# EAGLE schematic test-aetzen (EAGLE 7.1.0)
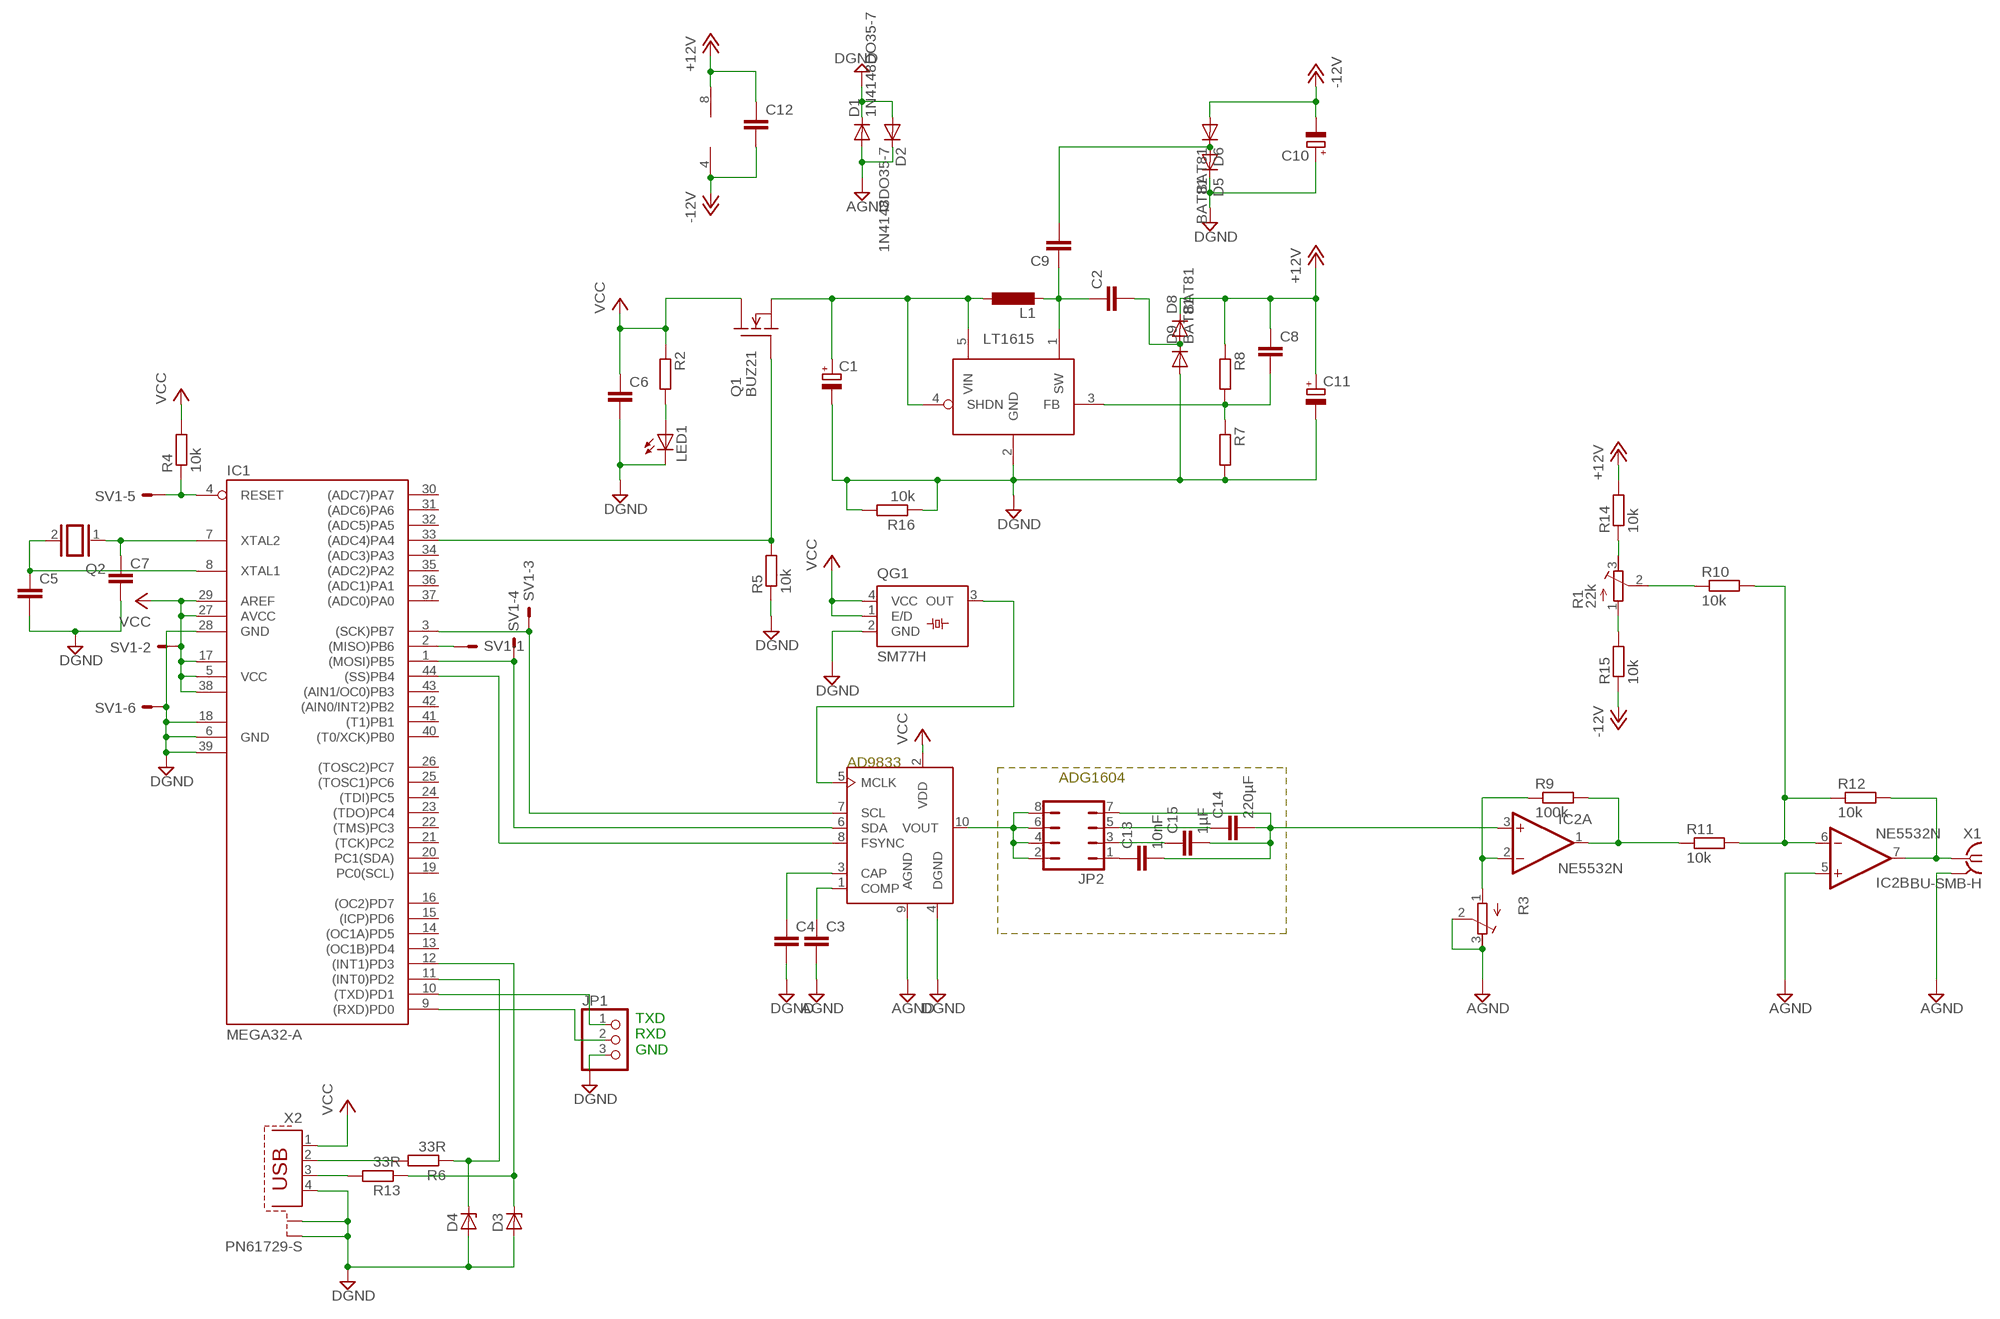
[diagram p0: schematic, sheet 1]

## Parts
C1  CPOL-EUE3.5-8  [E3,5-8]
C2  C-EU025-024X044  [C025-024X044]
C3  C-EU025-024X044  [C025-024X044]
C4  C-EU025-024X044  [C025-024X044]
C5  C-EU025-024X044  [C025-024X044]
C6  C-EU025-024X044  [C025-024X044]
C7  C-EU025-024X044  [C025-024X044]
C8  C-EU025-024X044  [C025-024X044]
C9  C-EU025-024X044  [C025-024X044]
C10  CPOL-EUE3.5-8  [E3,5-8]
C11  CPOL-EUE3.5-8  [E3,5-8]
C12  C-EU025-024X044  [C025-024X044]
C13  10nF  C-EU025-024X044  [C025-024X044]
C14  220µF  C-EU025-024X044  [C025-024X044]
C15  1µF  C-EU025-024X044  [C025-024X044]
D1  1N4148DO35-7  [DO35-7]
D2  1N4148DO35-7  [DO35-7]
D3  ZENER-DIODEDO35Z10  [DO35Z10]
D4  ZENER-DIODEDO35Z10  [DO35Z10]
D5  BAT81  [DO34-7]
D6  BAT81  [DO34-7]
D8  BAT81  [DO34-7]
D9  BAT81  [DO34-7]
IC1  MEGA32-A  [TQFP44]
IC2  NE5532N  [DIL08]
JP1  PINHD-1X3  [1X03]
JP2  JP4Q  [JP4Q]
L1  L-EU0207/10  [0207/10]
LED1  LED5MM  [LED5MM]
Q1  BUZ21  [TO220V]
Q2  XTAL/S  [QS]
QG1  SM77H  [SM77H]
R1  22k  R-TRIMM64Y  [RTRIM64Y]
R2  R-EU_0207/10  [0207/10]
R3  R-TRIMM64Y  [RTRIM64Y]
R4  10k  R-EU_M1206  [M1206]
R5  10k  R-EU_M1206  [M1206]
R6  33R  R-EU_0207/10  [0207/10]
R7  R-EU_0207/10  [0207/10]
R8  R-EU_0207/10  [0207/10]
R9  100k  R-EU_0207/10  [0207/10]
R10  10k  R-EU_M1206  [M1206]
R11  10k  R-EU_M1206  [M1206]
R12  10k  R-EU_M1206  [M1206]
R13  33R  R-EU_0207/10  [0207/10]
R14  10k  R-EU_M1206  [M1206]
R15  10k  R-EU_M1206  [M1206]
R16  10k  R-EU_M1206  [M1206]
SV1  ML6E  [ML6]
U$1  AD9833-P  [DIL10]
U$2  LT1615  [SOT23-5]
X1  BU-SMB-H  [BU-SMB-H]
X2  PN61729-S  [PN61729-S]

## Nets
+12V: C8.1 C11.+ C12.1 D8.C IC2.8(P:V+) R8.1 R14.2
-12V: C10.- C12.2 D6.A IC2.4(P:V-) R15.1
AGND: C3.2 D1.A D2.C IC2.5(B:+IN) R3.2(S) R3.3(E) U$1.9(AGND) X1.2 X1.3 X1.4 X1.5
DGND: C1.- C4.2 C5.2 C6.2 C7.2 C10.+ C11.- D1.C D2.A D3.A D4.A D5.C D9.A IC1.6(GND) IC1.18(GND1) IC1.28(GND) IC1.39(GND2) JP1.3 LED1.K(C) QG1.2(GND) R5.1 R7.2 R16.1 R16.2 SV1.6 U$1.4(DGND) U$2.2(GND) X2.4 X2.S1 X2.S2
N$1: IC1.3((SCK)PB7) SV1.3 U$1.7(SCL)
N$2: D4.C IC1.11((INT0)PD2) R6.1
N$3: C3.1 U$1.1(COMP)
N$4: IC1.1((MOSI)PB5) SV1.4 U$1.6(SDA)
N$5: D3.C IC1.12((INT1)PD3) R13.1
N$6: IC1.44((SS)PB4) U$1.8(FSYNC)
N$7: C1.+ L1.1 Q1.3(S) U$2.4(SHDN) U$2.5(VIN)
N$8: IC1.2((MISO)PB6) SV1.1
N$9: C4.1 U$1.3(CAP)
N$10: IC1.4(RESET) R4.1 SV1.5
N$11: QG1.3(OUT) U$1.5(MCLK)
N$12: IC1.33((ADC4)PA4) Q1.1(G) R5.2
N$13: R6.2 X2.2
N$14: R13.2 X2.3
N$15: R1.3(E) R14.1
N$16: IC1.9((RXD)PD0) JP1.2
N$17: LED1.A R2.2
N$18: R1.1(A) R15.2
N$19: C7.1 IC1.7(XTAL2) Q2.1
N$20: C8.2 R7.1 R8.2 U$2.3(FB)
N$21: JP2.2 JP2.4 JP2.6 JP2.8 U$1.10(VOUT)
N$22: C9.2 D5.A D6.C
N$23: C2.1 C9.1 L1.2 U$2.1(SW)
N$24: C14.1 JP2.5
N$25: C2.2 D8.A D9.C
N$26: C13.1 JP2.1
N$27: IC2.2(A:-IN) R3.1(A) R9.1
N$28: C13.2 C14.2 C15.2 IC2.3(A:+IN) JP2.7
N$29: IC2.1(A:OUT) R9.2 R11.1
N$30: IC2.6(B:-IN) R10.2 R11.2 R12.1
N$31: IC2.7(B:OUT) R12.2 X1.1
N$32: C15.1 JP2.3
N$33: C5.1 IC1.8(XTAL1) Q2.2
N$34: R1.2(S) R10.1
N$40: IC1.10((TXD)PD1) JP1.1
VCC: C6.1 IC1.5(VCC) IC1.17(VCC1) IC1.27(AVCC) IC1.29(AREF) IC1.38(VCC2) Q1.2(D) QG1.1(E/D) QG1.4(VCC) R2.1 R4.2 SV1.2 U$1.2(VDD) X2.1
Unconnected: IC1.13((OC1B)PD4) IC1.14((OC1A)PD5) IC1.15((ICP)PD6) IC1.16((OC2)PD7) IC1.19(PC0(SCL)) IC1.20(PC1(SDA)) IC1.21((TCK)PC2) IC1.22((TMS)PC3) IC1.23((TDO)PC4) IC1.24((TDI)PC5) IC1.25((TOSC1)PC6) IC1.26((TOSC2)PC7) IC1.30((ADC7)PA7) IC1.31((ADC6)PA6) IC1.32((ADC5)PA5) IC1.34((ADC3)PA3) IC1.35((ADC2)PA2) IC1.36((ADC1)PA1) IC1.37((ADC0)PA0) IC1.40((T0/XCK)PB0) IC1.41((T1)PB1) IC1.42((AIN0/INT2)PB2) IC1.43((AIN1/OC0)PB3)

## Notes on the sheet
- AD9833
- ADG1604
- TXD
  RXD
  GND

## Library data of the parts
C1 C10 C11 = rcl:CPOL-EU: POLARIZED CAPACITOR, European symbol
C2-C9 C12-C15 = rcl:C-EU: CAPACITOR, European symbol
D1 D2 = diode:1N4148: DIODE high speed (Philips)
D3 D4 = diode:ZENER-DIODE: Z-Diode
D5 D6 D8 D9 = diode:BAT81: DIODE barrier diode
IC1 = atmel:MEGA32: MICROCONTROLLER 32 Kbytes FLASH 2 Kbytes SRAM 1 Kbytes EEPROM USART 8-channel 10 bit ADC Source: www.atmel.com .. doc2503.pdf; MPN: ATMEGA32-16AU; OC_FARNELL: 9171274; OC_NEWARK: 69K6677
IC2 = linear:NE5532: AUDIO AMPLIFIER
JP1 = pinhead:PINHD-1X3: PIN HEADER
JP2 = jumper:JP4Q: JUMPER
L1 = rcl:L-EU: INDUCTOR, European symbol
LED1 = led:LED: LED OSRAM: - CHIPLED LG R971, LG N971, LY N971, LG Q971, LY Q971, LO R971, LY R971 LH N974, LH R974 LS Q976, LO Q976, LY Q976 LO Q996 - Hyper CHIPLED LW Q18S LB Q993, LB Q99A, LB R99A - SideLED LS A670, LO A670, LY A670, LG A670, LP A670 LB A673, LV A673, LT A673, LW A673 LH A674 LY A675 LS A676, LA A676, LO A676, LY A676, LW A676 LS A679, LY A679, LG A679 - Hyper Micro SIDELED® LS Y876, LA Y876, LO Y876, LY Y876 LT Y87S - SmartLED LW L88C, LW L88S LB L89C, LB L89S, LG L890 LS L89K, LO L89K, LY L89K LS L896, LA L896, LO L896, LY L896 - TOPLED LS T670, LO T670, LY T670, LG T670, LP T670 LSG T670, LSP T670, LSY T670, LOP T670, LYG T670 LG T671, LOG T671, LSG T671 LB T673, LV T673, LT T673, LW T673 LH T674 LS T676, LA T676, LO T676, LY T676, LB T676, LH T676, LSB T676, LW T676 LB T67C, LV T67C, LT T67C, LS T67K, LO T67K, LY T67K, LW E67C LS E67B, LA E67B, LO E67B, LY E67B, LB E67C, LV E67C, LT E67C LW T67C LS T679, LY T679, LG T679 LS T770, LO T770, LY T770, LG T770, LP T770 LB T773, LV T773, LT T773, LW T773 LH T774 LS E675, LA E675, LY E675, LS T675 LS T776, LA T776, LO T776, LY T776, LB T776 LHGB T686 LT T68C, LB T68C - Hyper Mini TOPLED® LB M676 - Mini TOPLED Santana® LG M470 LS M47K, LO M47K, LY M47K Source: http://www.osram.convergy.de LUXEON: - LUMILED® LXK2-PW12-R00, LXK2-PW12-S00, LXK2-PW14-U00, LXK2-PW14-V00 LXK2-PM12-R00, LXK2-PM12-S00, LXK2-PM14-U00 LXK2-PE12-Q00, LXK2-PE12-R00, LXK2-PE12-S00, LXK2-PE14-T00, LXK2-PE14-U00 LXK2-PB12-K00, LXK2-PB12-L00, LXK2-PB12-M00, LXK2-PB14-N00, LXK2-PB14-P00, LXK2-PB14-Q00 LXK2-PR12-L00, LXK2-PR12-M00, LXK2-PR14-Q00, LXK2-PR14-R00 LXK2-PD12-Q00, LXK2-PD12-R00, LXK2-PD12-S00 LXK2-PH12-R00, LXK2-PH12-S00 LXK2-PL12-P00, LXK2-PL12-Q00, LXK2-PL12-R00 Source: www.luxeon.com KINGBRIGHT: KA-3528ASYC Source: www.kingbright.com
Q1 = transistor-fet:BUZ21: N-Channel Enhancement MOSFET 100V; 19A; 0,1Ohm
Q2 = special:XTAL/S: CRYSTAL
QG1 = crystal:SM77H: 3.3V CMOS Clock Oscillator Source: www.pletronics.com .. sm77h%203.3v.pdf; OC_FARNELL: unknown; OC_NEWARK: unknown
R1 R3 = rcl:R-TRIMM: Trimm resistor
R2 R4-R16 = rcl:R-EU_: RESISTOR, European symbol
SV1 = con-harting-ml:ML6?E: HARTING; OC_FARNELL: unknown; OC_NEWARK: unknown
U$1 = analog-devices:AD9833: AD9833 DDS-IC Information: analog.com
U$2 = linear:LT1615
X1 = con-coax:BU-SMB-H: FEMALE SMB CONNECTOR Radiall distributor RS 112-3003; OC_FARNELL: unknown; OC_NEWARK: unknown
X2 = con-berg:PN61729-S: BERG USB connector; OC_FARNELL: unknown; OC_NEWARK: unknown